# Altium project PCB_tesis.PrjPcb
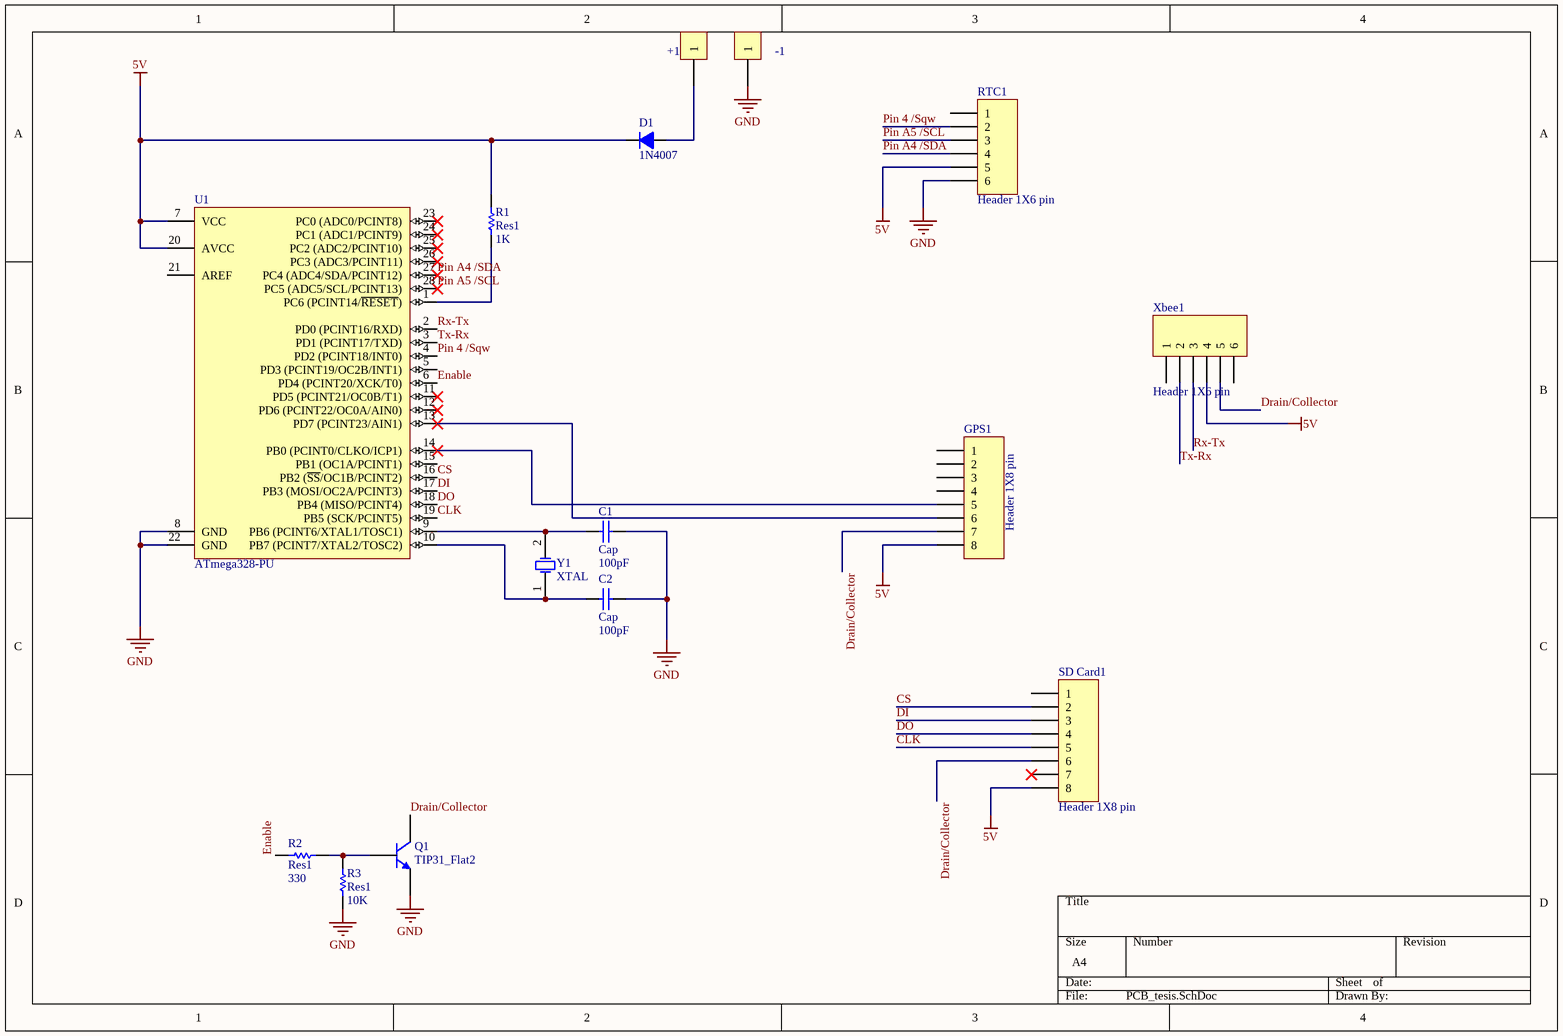
[diagram p0: PCB_tesis.SchDoc]
1 sheet, 15 parts. Net scope: global (net labels, ports and power ports of the same name join across sheets).
Board file: PCB_tesis.PcbDoc

## Sheet PCB_tesis.SchDoc
size A4

### Parts
+1  Header 1X1 pin  [1x1POS_HEAD-SOCK_LOWPROF]  (value not drawn)
-1  Header 1X1 pin  [1x1POS_HEAD-SOCK_LOWPROF]  (value not drawn)
C1  Cap  value 100pF  [Ceramic Capacitor]
C2  Cap  value 100pF  [Ceramic Capacitor]
D1  1N4007  [D2A]
GPS1  Header 1X8 pin  [HDR1X9]
Q1  TIP31_Flat2  [TO-220VS]
R1  Res1  value 1K  [AXIAL-0.3]
R2  Res1  value 330  [AXIAL-0.3]
R3  Res1  value 10K  [AXIAL-0.3]
RTC1  Header 1X6 pin  [1x6POS_HEAD_MALE_GRAY]
SD_Card1  Header 1X8 pin  [1x8POS_HEAD_MALE_GRAY]
U1  ATmega328-PU  [28P3]
Xbee1  Header 1X6 pin  [1x6POS_HEAD_MALE_GRAY]
Y1  XTAL  [HC-49U]

### Nets
5V: D1.2(K) GPS1.8 R1.2 RTC1.5 SD_Card1.8 U1.7(VCC) U1.20(AVCC) Xbee1.4
GND: -1.1 C1.2 C2.2 Q1.3(Emisor) R3.1 RTC1.6 U1.8(GND) U1.22(GND)
CLK: SD_Card1.5 U1.19(PB5_(SCK/PCINT5))
CS: SD_Card1.2 U1.16(PB2_(~{SS}/OC1B/PCINT2))
DI: SD_Card1.3 U1.17(PB3_(MOSI/OC2A/PCINT3))
DO: SD_Card1.4 U1.18(PB4_(MISO/PCINT4))
Drain/Collector: GPS1.7 Q1.2(Colector) SD_Card1.6 Xbee1.5
Enable: R2.2 U1.6(PD4_(PCINT20/XCK/T0))
Pin 4 /Sqw: RTC1.2 U1.4(PD2_(PCINT18/INT0))
Pin A4 /SDA: RTC1.4 U1.27(PC4_(ADC4/SDA/PCINT12))
Pin A5 /SCL: RTC1.3 U1.28(PC5_(ADC5/SCL/PCINT13))
Rx-Tx: U1.2(PD0_(PCINT16/RXD)) Xbee1.3
Tx-Rx: U1.3(PD1_(PCINT17/TXD)) Xbee1.2
Net+1_1: +1.1 D1.1(A)
NetC1_1: C1.1 U1.9(PB6_(PCINT6/XTAL1/TOSC1)) Y1.2(OSC2)
NetC2_1: C2.1 U1.10(PB7_(PCINT7/XTAL2/TOSC2)) Y1.1(OSC1)
NetGPS1_5: GPS1.5 U1.14(PB0_(PCINT0/CLKO/ICP1))
NetGPS1_6: GPS1.6 U1.13(PD7_(PCINT23/AIN1))
NetQ1_1: Q1.1(Base) R2.1 R3.2
NetR1_1: R1.1 U1.1(PC6_(PCINT14/~{RESET}))

Not connected (* = marked no-connect by the designer): GPS1 1 2 3 4; RTC1 1; SD_Card1 1 7*; U1 5(PD3_(PCINT19/OC2B/INT1)) 11(PD5_(PCINT21/OC0B/T1))* 12(PD6_(PCINT22/OC0A/AIN0))* 15(PB1_(OC1A/PCINT1)) 21(AREF) 23(PC0_(ADC0/PCINT8))* 24(PC1_(ADC1/PCINT9))* 25(PC2_(ADC2/PCINT10))* 26(PC3_(ADC3/PCINT11))*; Xbee1 1 6

### Library data of the parts
+1 -1 = Header 1X1 pin: Revised: Zion Blue; Published: 6-May-2014; Publisher: Cynetik Group
C1 C2 = Cap: Capacitor; Published: 8-Jun-2000; LatestRevisionDate: 17-Jul-2002; LatestRevisionNote: Re-released for DXP Platform.; PackageReference: RAD-0.3; Publisher: Altium Limited; PackageDescription: Radial Cap, Thru-Hole; 2 Leads; 0.3 in Pin Spacing
D1 = 1N4007: Diode 1A; Value: 1N4007
GPS1 SD_Card1 = Header 1X8 pin: Header, 1X8-Pin; Revised: Zion Blue; Published: 6-May-2014; Publisher: Cynetik Group
Q1 = TIP31_Flat2: NPN Epitaxial Silicon Transistor; Latest Reviewer: Fenrrich; Latest Revision Note: URL replaced; Publisher: Cynetik Group; Published: 6-Jun-2014; ComponentLinkURL: https://www.fairchildsemi.com/datasheets/TI/TIP31C.pdf; Latest Revision Date: 21-Jan-2015
R1-R3 = Res1: Resistor; Published: 8-Jun-2000; LatestRevisionDate: 17-Jul-2002; LatestRevisionNote: Re-released for DXP Platform.; PackageReference: AXIAL-0.3; Publisher: Altium Limited; PackageDescription: Axial Device, Thru-Hole; 2 Leads; 0.3 in Pin Spacing
RTC1 Xbee1 = Header 1X6 pin: Header, 1X6-Pin; Revised: Zion Blue; Published: 6-May-2014; Publisher: Cynetik Group
U1 = ATmega328-PU: 8-bit AVR Microcontroller, 32KB Flash, 1KB EEPROM, 2KB SRAM, 28-pin PDIP, Industrial Grade (-40°C to 85°C); Published: 1-Apr-2010; DatasheetVersion: revA, Jan-2010; PackageVersion: revB, Sep-2001; PackageReference: 28P3; Publisher: Altium Limited; PackageDescription: 28-lead (0.300"/7.62mm Wide) Plastic Dual Inline Package (PDIP); Supplier 1: Digi-Key; Supplier Part Number 1: ATMEGA328-PU-ND; Supplier 2: Mouser; Supplier Part Number 2: 556-ATMEGA328-PU; ComponentLink1Description: Manufacturer Link; ComponentLink1URL: http://www.atmel.com/products/avr/default.asp?; ComponentLink2Description: ATmega48A/48PA/88A/88PA/168A/168PA/328/328P Datasheet; ComponentLink2URL: http://www.atmel.com/dyn/resources/prod_documents/8271.pdf; ComponentLink3Description: ATmega48A/48PA/88A/88PA/168A/168PA/328/328P Summary; ComponentLink3URL: http://www.atmel.com/dyn/resources/prod_documents/8271S.pdf; ComponentLink4Description: Atmel.com Home; ComponentLink4URL: http://www.atmel.com
Y1 = XTAL: Crystal Oscillator; Published: 8-Jun-2000; LatestRevisionDate: 17-Jul-2002; LatestRevisionNote: Re-released for DXP Platform.; PackageReference: R38; Publisher: Altium Limited; PackageDescription: Crystal, Thru-Hole; 2 Leads; Body 3.1 x 8.2 mm (Dia.xH)